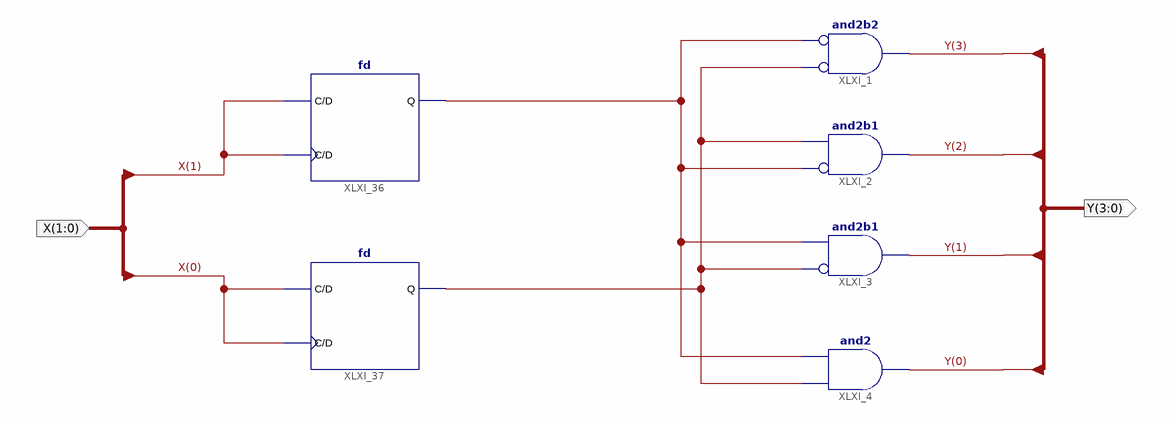
[diagram p0: schematic sheet 1]
// Xilinx ISE schematic modeDecoder.sch (spartan6) as structural Verilog: 6 symbols, 2 ports
module modeDecoder (
  input  [1:0] X,
  output [3:0] Y
);

  wire XLXN_69, XLXN_74;

  fd XLXI_36 (.C(X[1]), .D(X[1]), .Q(XLXN_69));
  fd XLXI_37 (.C(X[0]), .D(X[0]), .Q(XLXN_74));
  and XLXI_4 (Y[0], XLXN_74, XLXN_69);
  and XLXI_3 (Y[1], ~XLXN_74, XLXN_69);  // and2b1
  and XLXI_2 (Y[2], ~XLXN_69, XLXN_74);  // and2b1
  and XLXI_1 (Y[3], ~XLXN_74, ~XLXN_69);  // and2b2
endmodule
